# Altium schematic sheet Sheet2.SchDoc: Power Supply
size 420 x 297 mm; DrawnBy: Nhat Hoang; SheetNumber: 2; SheetTotal: 5; MasterProject: POWER METER; SubSystem: Power&Measurement
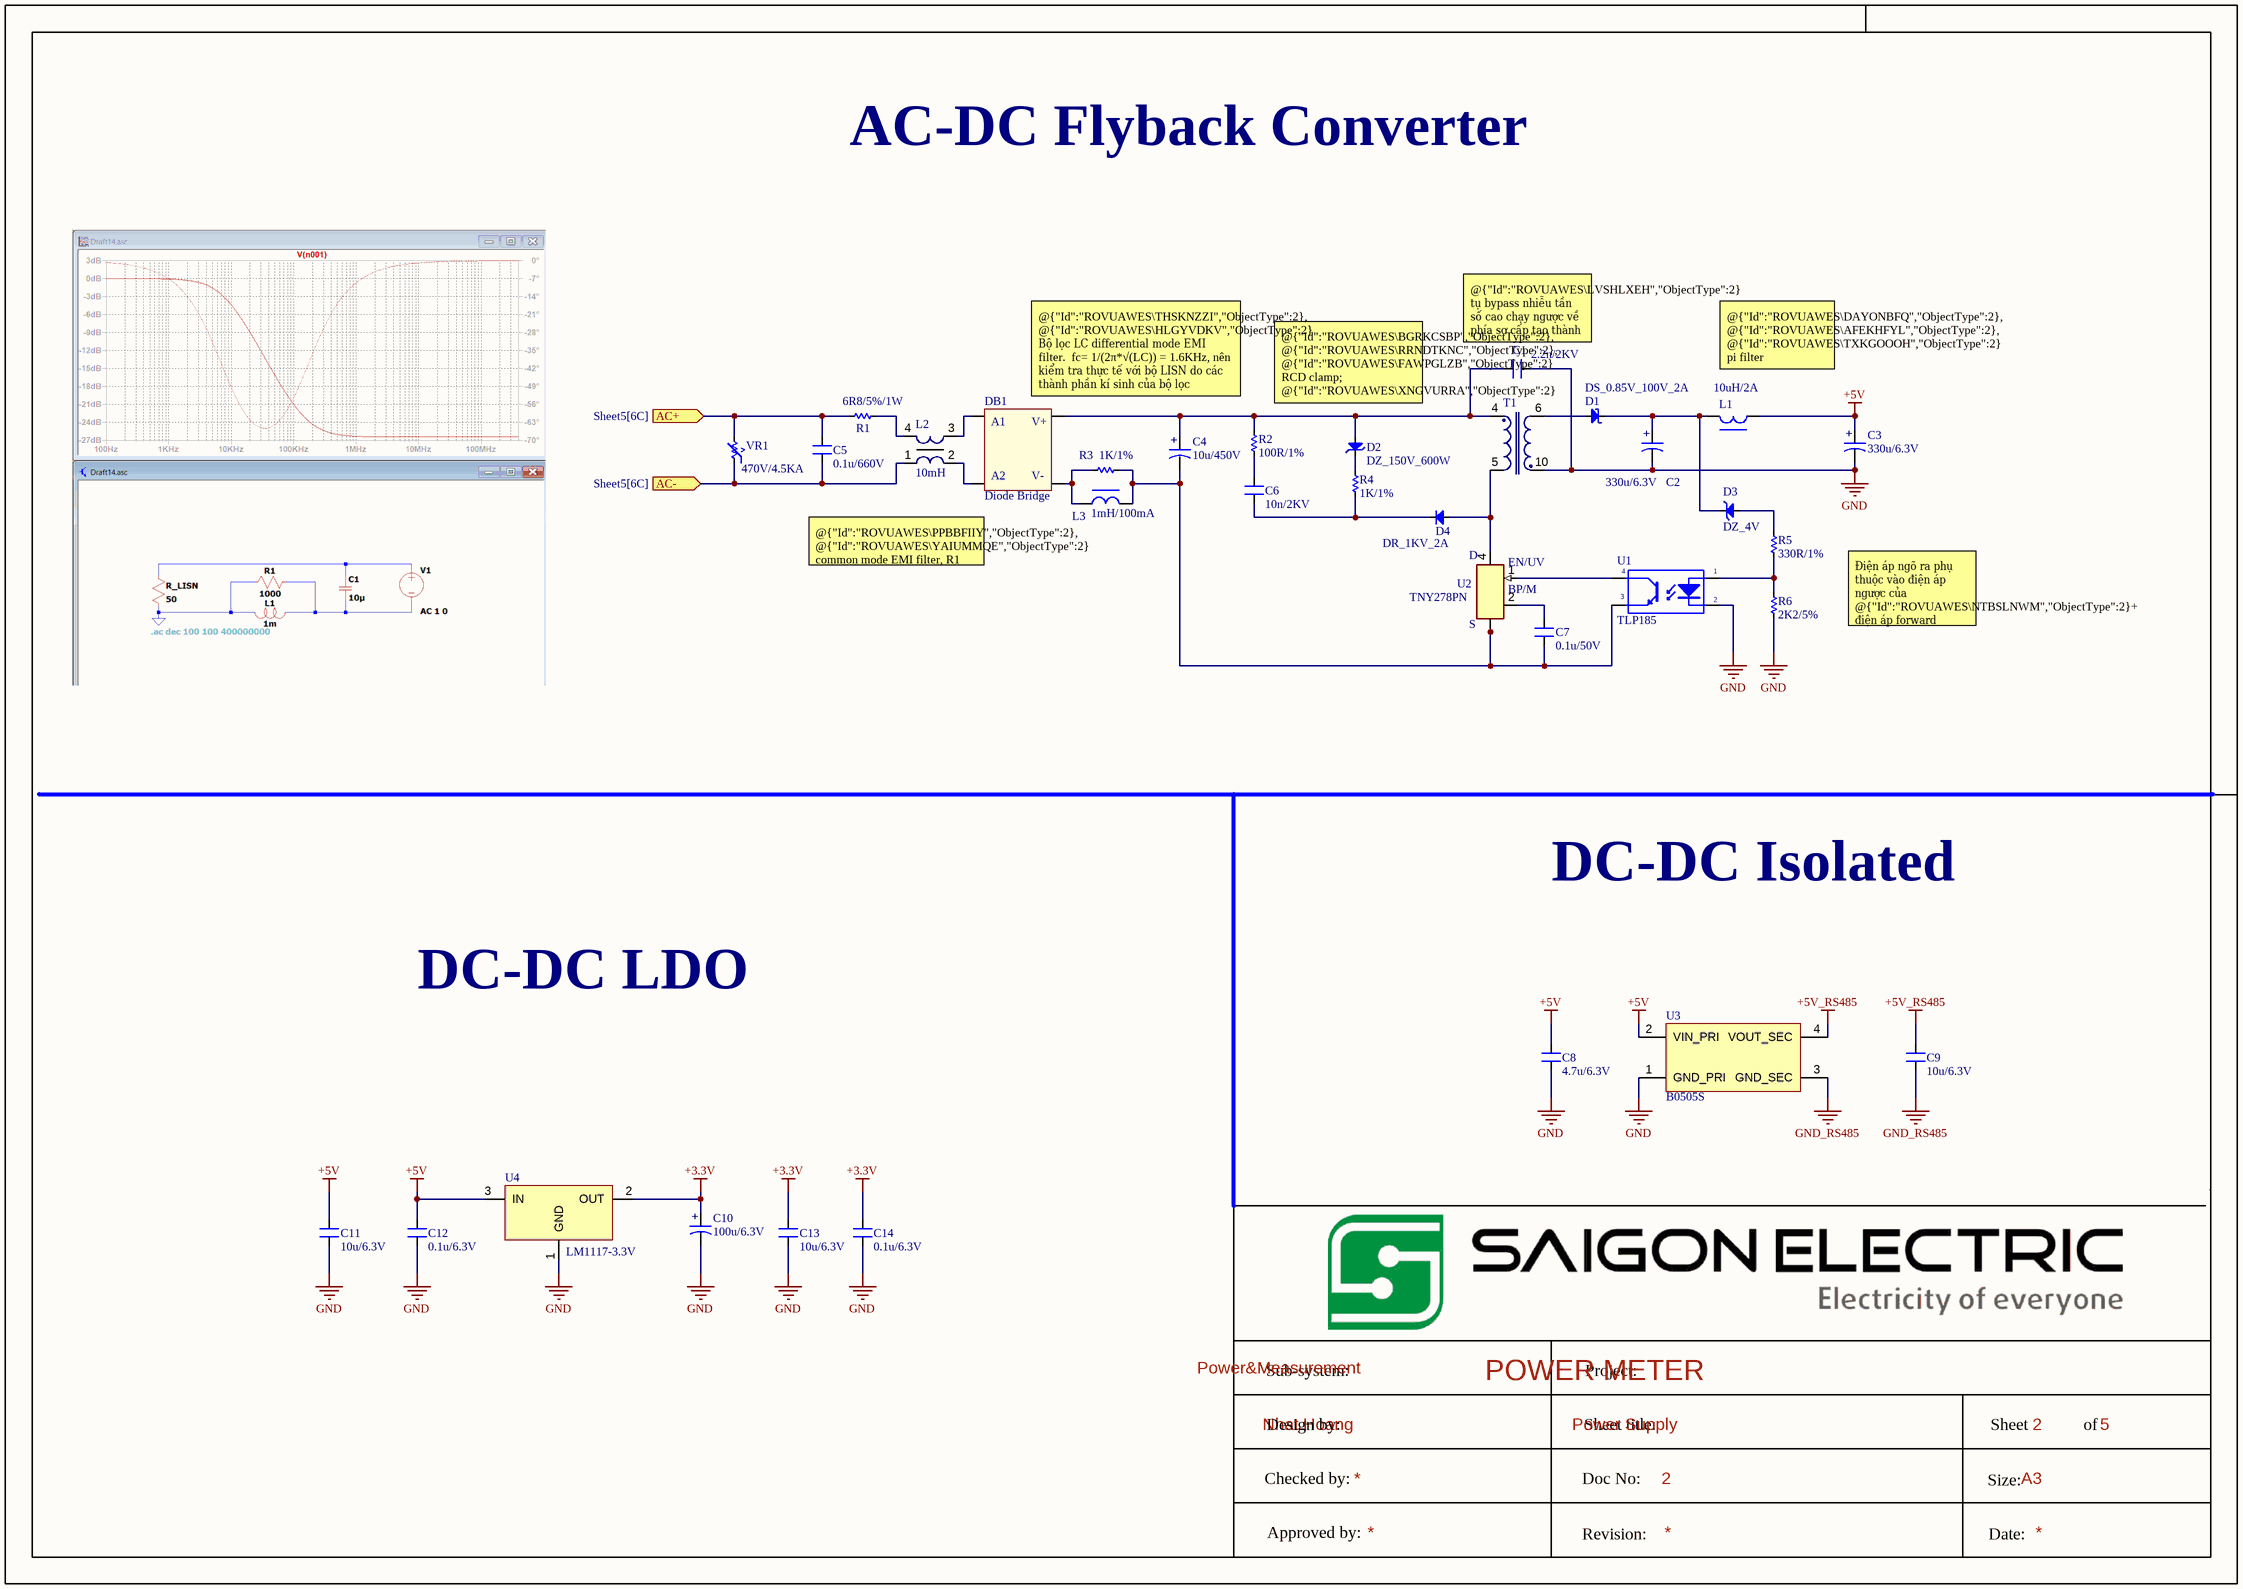
[diagram p0: Sheet2.SchDoc]

## Parts
C1  2.2n/2KV  [CN2-B]
C2  330u/6.3V  [CAPAE9383X105M]
C3  330u/6.3V  [CAPAE9383X105M]
C4  10u/450V  [CA-ALU-10BL]
C5  0.1u/660V  [CAPRR1500W60L1750T900H1600]
C6  10n/2KV  [CAPRB750W60L1450T500H1850]
C7  0.1u/50V  [RES_C_3216X70]
C8  4.7u/6.3V  [CAP_C_2012X110]
C9  10u/6.3V  [CAP_C_2012X110]
C10  100u/6.3V  [CAP-ALU-SMD-6.3x7.7x2.2]
C11  10u/6.3V  [CAP_C_2012X110]
C12  0.1u/6.3V  [CAP_C_2012X110]
C13  10u/6.3V  [CAP_C_2012X110]
C14  0.1u/6.3V  [CAP_C_2012X110]
D1  DS_0.85V_100V_2A  [DIOM5025X26N]
D2  DZ_150V_600W  [DIOM4436X26N]
D3  DZ_4V  [LL-34]
D4  DR_1KV_2A  [DIOM5025X26N]
DB1  Diode Bridge  [diode bridge 2A]
L1  10uH/2A  [L-DIP-M-10]
L2  10mH  [UU98LFH142LF]
L3  1mH/100mA  [L-DIP-M-10]
R1  6R8/5%/1W  [RES-1W]
R2  100R/1%  [RES_C_3216X70]
R3  1K/1%  [RES_C_3216X70]
R4  1K/1%  [RES_C_3216X70]
R5  330R/1%  [RES_C_2012X65]
R6  2K2/5%  [RES_C_2012X65]
T1  (no value)  [BOBBIN_EE13/6/6]
U1  TLP185  [SOP254P700X220-4N]
U2  TNY278PN  [IC_TNY274PN]
U3  B0505S  [B0505S-1W]
U4  LM1117-3.3V  [SOT230P700X180-4N]
VR1  470V/4.5KA  [B72214P2301K101]

## Ports
AC+ (in, see Sheet5[6C]), AC- (in, see Sheet5[6C])

## Nets
+3.3V: C10.1 C13.2 C14.2 U4.2(OUT)
+5V: C3.1 C8.2 C11.2 C12.2 L1.1 U3.2(VIN_PRI) U4.3(IN)
+5V_RS485: C9.2 U3.4(VOUT_SEC)
GND: C1.1 C2.2 C3.2 C8.1 C10.2 C11.1 C12.1 C13.1 C14.1 R6.2 T1.10 U1.2(K) U3.1(GND_PRI) U4.1(GND)
GND_RS485: C9.1 U3.3(GND_SEC)
AC+: C5.2 R1.1 VR1.1 ; port AC+
AC-: C5.1 L2.1 VR1.2 ; port AC-
NetC1_2: C1.2 C4.1 D2.2(A) DB1.1(+V_OUT) R2.1 T1.4
NetC2_1: C2.1 D1.1(K) D3.1(K) L1.2
NetC4_2: C4.2 C7.1 L3.2 R3.1 U1.3(E) U2.5(S) U2.6(S) U2.7(S) U2.8(S)
NetC6_1: C6.1 D4.2(K) R4.2
NetC6_2: C6.2 R2.2
NetC7_2: C7.2 U2.2(BP/M)
NetD1_2: D1.2(A) T1.6
NetD2_1: D2.1(K) R4.1
NetD3_2: D3.2(A) R5.1
NetD4_1: D4.1(A) T1.5 U2.4(D)
NetDB1_2: DB1.2(-V_OUT) L3.1 R3.2
NetDB1_3: DB1.3(AC1) L2.3
NetDB1_4: DB1.4(AC2) L2.2
NetL2_4: L2.4 R1.2
NetR5_2: R5.2 R6.1 U1.1(A)
NetU1_4: U1.4(C) U2.1(EN/UV)

## Notes on the sheet
- AC-DC Flyback Converter
- (near DB1) @{"Id":"ROVUAWES\THSKNZZI","ObjectType":2}, @{"Id":"ROVUAWES\HLGYVDKV","ObjectType":2} Bộ lọc LC differential mode EMI filter.  fc= 1/(2π*√(LC)) = 1.6KHz, nên kiểm tra thực tế với bộ LISN do các thành phần kí sinh của bộ lọc
- @{"Id":"ROVUAWES\BGRKCSBP","ObjectType":2}, @{"Id":"ROVUAWES\RRNDTKNC","ObjectType":2}, @{"Id":"ROVUAWES\FAWPGLZB","ObjectType":2} RCD clamp; @{"Id":"ROVUAWES\XNGVURRA","ObjectType":2} cho mạch RCD cắt gai điện áp chính xác 150V, @{"Id":"ROVUAWES\RODIOJRO","ObjectType":2} hạn dòng qua @{"Id":"ROVUAWES\XNGVURRA","ObjectType":2} .
- (near C1) @{"Id":"ROVUAWES\LVSHLXEH","ObjectType":2} tụ bypass nhiễu tần số cao chạy ngược về phía sơ cấp tạo thành vòng kín
- (near L1) @{"Id":"ROVUAWES\DAYONBFQ","ObjectType":2}, @{"Id":"ROVUAWES\AFEKHFYL","ObjectType":2}, @{"Id":"ROVUAWES\TXKGOOOH","ObjectType":2} pi filter
  fc= 1/(π*√(LC)) = 5.54Khz
- @{"Id":"ROVUAWES\PPBBFIIY","ObjectType":2}, @{"Id":"ROVUAWES\YAIUMMQE","ObjectType":2} common mode EMI filter, R1 resonace damping
- Điện áp ngõ ra phụ thuộc vào điện áp ngược của @{"Id":"ROVUAWES\NTBSLNWM","ObjectType":2}+ điện áp forward @{"Id":"ROVUAWES\CDZODUNL","ObjectType":2}
- DC-DC Isolated
- DC-DC LDO
- Sub-system:
- Project:
- Design by:
- Sheet title:
- Sheet
- of
- Checked by:
- Approved by:
- Doc No:
- Revision:
- Size:
- Date:
- A3
- (in symbol CAP_POLAR) +
- (in symbol DIODE BRIGDE) A1; V+; A2; V-

## Library data of the parts
C1 C5-C9 C11-C14 = CAP_SMD
C2-C4 C10 = CAP_POLAR
  C2 C3: LCSC Part #: C19606
D1 = DIODE schottky: Schottky
D2 D3 = DIODE Zener: Zenner
D4 = Diode: Default Diode; Code - JEDEC: DO-214-AB; Value: 1N5007; Published: 8-Jun-2000; Revision: July-2002: Re-released for DXP Platform.; Publisher: Altium Limited
DB1 = DIODE BRIGDE: Convert AC to DC voltage, 4 pin; Value: Cau 1A; LCSC Part #: *
L1 L3 = L-DIP-1: Inductor; Value: 150 mH
L2 = L-DIP-2: partNo: 744284100; Manufacturer: Würth Elektronik eiSos GmbH; Inductance: 10mH; ComponentLink1Description: Manufacturer; ComponentLink1URL: http://www.we-online.de; Created by: Christin Zierenner; Created Date: March 2012; ComponentLink2Description: Datasheet; ComponentLink2URL: http://www.we-online.de/katalog/media/pdf/744284100.pdf
R1-R6 = Res-SMD: Resistor; Manufacturer: Generic Components; Class: Passive; Published: 08/06/2000; Publisher: Altium Hobart Technology Centre
T1 = Trans: Off-Line Transformer WE-UNIT , L=2.5mH; PartNo: 7491181012; Manufacturer: Würth Elektronik eiSos GmbH; Inductance: 2.8mH; Turns Ratio: 8.1:1; Input Voltage (AC): 85-265; Output Current (A): 0.25; Output Voltage (DC): 12; ComponentLink1Description: Manufacturer; ComponentLink1URL: http://www.we-online.de; Created by: Otto Christin; Created Date: OCT 2013; ComponentLink2Description: Datasheet; ComponentLink2URL: http://www.we-online.de/katalog/media/pdf/7491181012.pdf; LCSC Part #: *
U1 = TLP185: Single Opto; Value: PC817
U2 = TNY284DG: Package: None; Price: None; MP: TNY284DG; Availability: Unavailable; LCSC Part #: *
U4 = LM1117: 800mA Low-Dropout Linear Regulator; Creator: Nguyen Ba Bien; Website: http://group3i.net
VR1 = Varistor: MOV-14D471K, Varistors 470V 14mm
U3 = B0505S: LCSC Part #: *